# Altium schematic sheet Relay Output.SchDoc
size A4
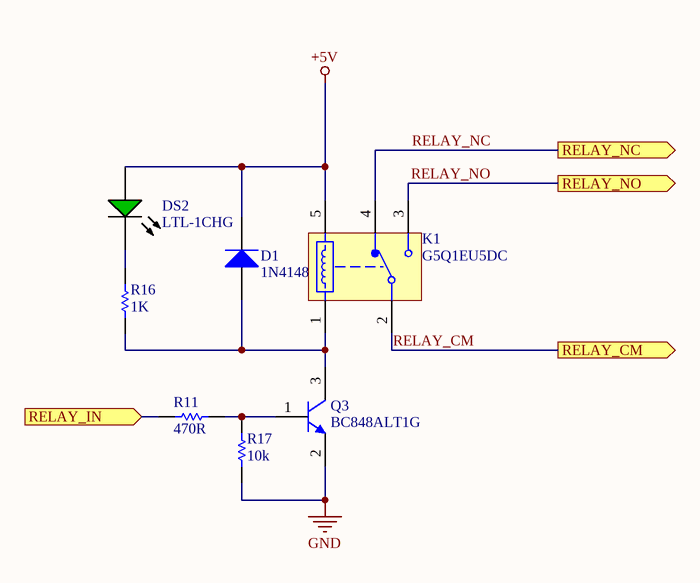
[diagram p0: Relay Output.SchDoc]

## Parts
D1  1N4148WT  [FAIR-SOD-523F-2_V]
DS2  LTL-1CHG  [LTST-LTL-1CHG-2]
K1  G5Q1EU5DC  [G5Q1EU5DC]
Q3  BC848ALT1G  [ONSC-SOT-23-3-318-08_V]
R11  470R  [RESC0603(1608)_M]
R16  1K  [RESC1608X55X30LL15T15]
R17  10k  [RESC1609X55X30LL15T15]

## Ports
RELAY_CM (out), RELAY_IN (in), RELAY_NC (out), RELAY_NO (out)

## Nets
+5V: D1.1(K) DS2.1(A) K1.5
GND: Q3.2(E) R17.1
RELAY_CM: K1.2 ; port RELAY_CM
RELAY_IN: R11.1 ; port RELAY_IN
RELAY_NC: K1.4 ; port RELAY_NC
RELAY_NO: K1.3 ; port RELAY_NO
NetD1_2: D1.2(A) K1.1 Q3.3(C) R16.1
NetDS2_2: DS2.2(K) R16.2
NetQ3_1: Q3.1(B) R11.2 R17.2

## Library data of the parts
D1 = CMP-0881-00001-1: High Conductance Fast Switching Diode, 75 V, -55 to 150 degC, 2-Pin SOD523F, RoHS; Manufacturer: Fairchild Semiconductor; IR (VR: 75 V)=5 uA Max.; VF: 1 V Max.; BVR (IR: 5 uA)=75 V Min.; CO: 4 pF Max.; DatasheetVersion: Rev. A2; ComponentLink1Description: Manufacturer URL; PackageDescription: 2-Pin Surface Mount Device, Body 1.2 x 0.8 mm, Height 0.7 mm; ComponentLink2URL: http://www.fairchildsemi.com/ds/1N/1N4148WT.pdf; ComponentLink2Description: Datasheet; PartNumber: 1N4148WT; ComponentLink1URL: http://www.fairchildsemi.com/; Temperature Range: -55 to 150 degC; Mounting Technology: Surface Mount; PackageReference: SOD-523F-2; RoHS: TRUE
DS2 = CMP-1674-00014-1: LITE-ON Electronic, INC, 120 mA, 100 mW, 5 V, -55 to 100 degC, 2-Pin THD, RoHS, Bulk; Case\Package: QFN; Max Supply Voltage: 3.6 V; Interface: I2C; Min Supply Voltage: 2.5 V; ComponentLink1URL: http://www.us.liteon.com/; DatasheetVersion: Mar-00; Max Operating Temperature: 85 degC; ComponentLink2URL: http://datasheet.octopart.com/LTL-1CHG-Lite-On-datasheet-143841.pdf; Min Operating Temperature: -40 degC; PackageReference: LTL-1CHG; RoHSCompliant: true; Pins: 24; PackageDescription: 2-Pin Through Hole Device, Dia 3.8 mm; ComponentLink1Description: Manufacturer URL; Packaging: Cut Tape; ComponentLink2Description: Datasheet; Package Quantity: 5000; REACH SVHC: No SVHC
K1 = G5Q1EU5DC: OMRON - G5Q-1EU 5DC - RELAY, SPDT, 250VAC, 30VDC, 10A; Coil Resistance: 63R; Coil Voltage (DC): 5V; Coil Type: Non-Latching; Coil Current: 80mA; Voltage Rating (AC): 277V; Operate Time: 10ms; Switching Capacity: 1.25kW; Ratings: IP67; Supplier 1: Distrelec; Manufacturer 1: Omron; Manufacturer Part Number 1: G5Q1EU5DC; Stock 1: 8265; Pricing 1: 10=1,55000, 50=1,31000 (EUR); RoHS: Yes; Mount: PCB; Number of Pins: 5; Contact Material: Silver; Min Operating Temperature: -40°C; Max Operating Temperature: 85°C; Contact Current Rating: 10A; Termination: PC Pin; Throw Configuration: SPDT; Switching Current: 10A; Length: 20.3mm; Height: 15.8mm; Depth: 10.3mm; Width: 10.3mm; REACH SVHC: Unknown; ComponentLink1URL: https://datasheet.ciiva.com/29336/503930-da-01-en-kompaktes-pcb-powerrelais-g5q-1-eu-5dc-29336254.pdf?src-supplier=Conrad; ComponentLink1Description: https://datasheet.ciiva.com/29336/503930-da-01-en-kompaktes-pcb-powerrelais-g5q-1-eu-5dc-29336254.pdf?src-supplier=Conrad; ComponentLink2URL: https://datasheet.ciiva.com/26311/g5q-eng-26311244.pdf?src-supplier=Distrelec; ComponentLink2Description: https://datasheet.ciiva.com/26311/g5q-eng-26311244.pdf?src-supplier=Distrelec; Supplier Part Number 1: 11072346
Q3 = CMP-1048-00699-1: General Purpose Transistor, NPN Silicon, 3-Pin SOT-23, Pb-Free, Tape and Reel; Manufacturer: On Semiconductor; fT Min (MHz): 100; IC Continuous (A): 0.1; PackageDescription: 3-Pin Small Outline Transistor, Body 2.92 x 1.3 mm, Pitch 0.95 mm; DatasheetVersion: Rev. 11; ComponentLink2URL: http://www.onsemi.cn/pub_link/Collateral/BC846ALT1-D.PDF; ComponentLink3Description: Package Specification; Packing: Tape and Reel; ComponentLink3URL: http://www.onsemi.cn/pub_link/Collateral/318-08.PDF; ComponentLink1Description: Manufacturer URL; ComponentLink1URL: http://www.onsemi.com/; PackageVersion: Rev. AP, 11/2009; PartNumber: BC848ALT1G; PackageReference: SOT-23-3-318-08; Polarity: NPN; RoHS: TRUE; ComponentLink2Description: Datasheet; Mounting Technology: Surface Mount
R11 = CMP-1012-00473-1: 470R 0.1W 1% 0603 (1608 Metric)  SMD; Value: 470.00 Ohm; Case-Metric: 1608; Case-EIA: 0603; Power: 0.1 W; Technology: SMT; Tolerance: 1 %
R16 = CMP-2000-00180-1: Part Number: ERJ-3EKF1001V; Manufacturer: Panasonic
R17 = CMP-2000-07452-1: Chip Resistor, 10 KOhm, +/- 1%, 0.1 W, -55 to 155 degC, 0603 (1608 Metric), RoHS, Tape and Reel; Manufacturer: Panasonic; Voltage Rating: 75V; Case\/Package: 0603; Power Rating: 100mW; Resistance: 10KOhm; Temperature Coefficient: 100ppm\/degreesC; Number of Pins: 2; Package Reference: 603; Depth: 0.8mm; Mount: SurfaceMount; Package Description: 2-Pin Surface Mount Device, Body 1.6 x 0.85 mm; Datasheet Version: 02/2017; Length: 1.6mm; Lead Free: LeadFree; Height: 0.45mm; Number of Terminations: 2; Max Power Dissipation: 100mW; Min Operating Temperature: -55degC; Datasheet URL: https://industrial.panasonic.com/cdbs/www-data/pdf/RDA0000/AOA0000C304.pdf; Termination: SMD/SMT; Case Code (Metric): 1608; Case Code (Imperial): 0603; Tolerance: 1%; Max Operating Temperature: 155degC; RoHSCompliant: true; Voltage Rating (DC): 75V; Radiation Hardening: No; Packaging: TapeandReel; Composition: ThickFilm; Mounting Technology: SurfaceMount; Manufacturer URL: http://www.panasonic.com/; Width: 0.031inch; REACH SVHC: NoSVHC; Contact Plating: Tin; Military Standard: Not; Package Quantity: 1